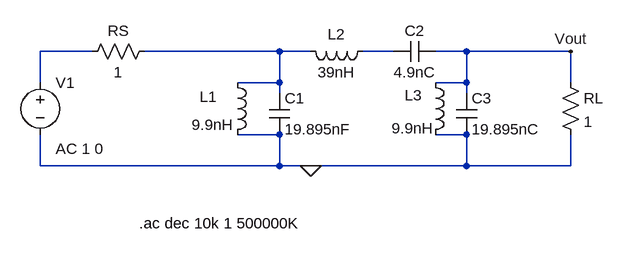
[diagram p0: schematic RXBANDPASS.asc]
RXBANDPASS.asc, the LTspice schematic file:
Version 4
SHEET 1 1012 680
WIRE 224 192 144 192
WIRE 512 192 304 192
WIRE 560 192 512 192
WIRE 688 192 640 192
WIRE 800 192 752 192
WIRE 960 192 800 192
WIRE 144 240 144 192
WIRE 512 240 512 192
WIRE 512 240 448 240
WIRE 800 240 800 192
WIRE 800 240 752 240
WIRE 960 240 960 192
WIRE 512 256 512 240
WIRE 800 256 800 240
WIRE 512 320 448 320
WIRE 800 320 752 320
WIRE 144 368 144 320
WIRE 512 368 512 320
WIRE 512 368 144 368
WIRE 560 368 512 368
WIRE 800 368 800 320
WIRE 800 368 560 368
WIRE 960 368 960 320
WIRE 960 368 800 368
FLAG 560 368 0
FLAG 960 192 Vout
SYMBOL Voltage 144 224 R0
WINDOW 3 24 96 Invisible 2
WINDOW 123 24 118 Left 2
SYMATTR Value ""
SYMATTR Value2 AC 1 0
SYMATTR InstName V1
SYMBOL Res 320 176 R90
WINDOW 0 0 56 VBottom 2
WINDOW 3 32 56 VTop 2
SYMATTR InstName RS
SYMATTR Value 1
SYMBOL Cap 496 256 R0
SYMATTR InstName C1
SYMATTR Value 19.895nF
SYMBOL Cap 784 256 R0
SYMATTR InstName C3
SYMATTR Value 19.895nC
SYMBOL Ind 656 176 R90
WINDOW 0 5 56 VBottom 2
WINDOW 3 32 56 VTop 2
SYMATTR InstName L2
SYMATTR Value 39nH
SYMBOL Res 944 224 R0
SYMATTR InstName RL
SYMATTR Value 1
SYMBOL ind 736 224 R0
WINDOW 0 -31 35 Left 2
WINDOW 3 -51 86 Left 2
SYMATTR InstName L3
SYMATTR Value 9.9nH
SYMBOL Ind 432 224 R0
WINDOW 0 -43 38 Left 2
WINDOW 3 -55 81 Left 2
SYMATTR InstName L1
SYMATTR Value 9.9nH
SYMBOL Cap 752 176 R90
WINDOW 0 0 32 VBottom 2
WINDOW 3 32 32 VTop 2
SYMATTR InstName C2
SYMATTR Value 4.9nC
TEXT 296 456 Left 2 !.ac dec 10k 1 500000K

The netlist it stands for:
* RXBANDPASS.asc
V1 N001 0 AC 1 0
RS N002 N001 1
C1 N002 0 19.895nF
C3 Vout 0 19.895nC
L2 N003 N002 39nH
RL Vout 0 1
L3 Vout 0 9.9nH
L1 N002 0 9.9nH
C2 Vout N003 4.9nC
.ac dec 10k 1 500000K
.backanno
.end